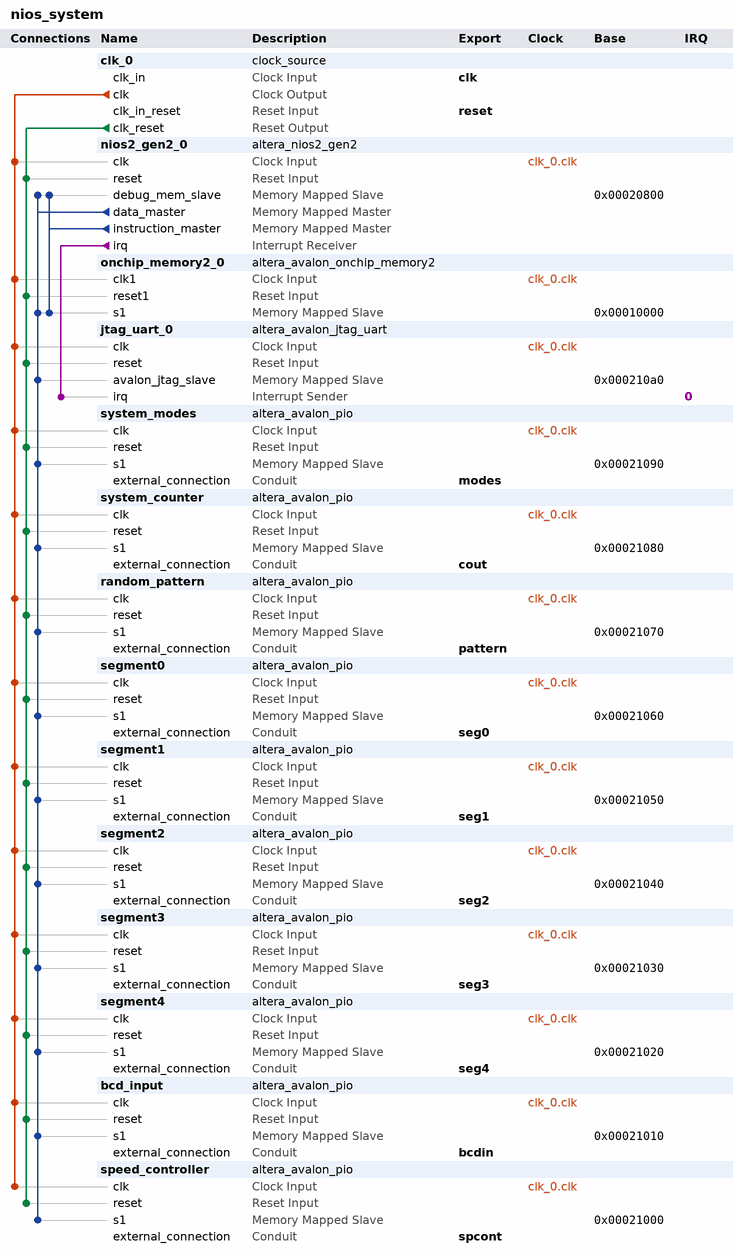
[diagram p0: system contents]
# Platform Designer (Qsys) system nios_system, Cyclone IV E EP4CE115F29C7
# Parameters at their usual value, and those the tool derives, are not listed.
package require -exact qsys 18.1
create_system nios_system
set_project_property DEVICE_FAMILY {Cyclone IV E}
set_project_property DEVICE EP4CE115F29C7

add_instance clk_0 clock_source 18.1
set_instance_parameter_value clk_0 clockFrequency 50000000

add_instance nios2_gen2_0 altera_nios2_gen2 18.1
set_instance_parameter_value nios2_gen2_0 dcache_size 4096
set_instance_parameter_value nios2_gen2_0 exceptionSlave onchip_memory2_0.s1
set_instance_parameter_value nios2_gen2_0 icache_size 4096
set_instance_parameter_value nios2_gen2_0 impl Fast
set_instance_parameter_value nios2_gen2_0 resetSlave onchip_memory2_0.s1

add_instance onchip_memory2_0 altera_avalon_onchip_memory2 18.1
set_instance_parameter_value onchip_memory2_0 dataWidth 32
set_instance_parameter_value onchip_memory2_0 dualPort false
set_instance_parameter_value onchip_memory2_0 initMemContent true
set_instance_parameter_value onchip_memory2_0 initializationFileName onchip_mem.hex
set_instance_parameter_value onchip_memory2_0 memorySize 65536

add_instance jtag_uart_0 altera_avalon_jtag_uart 18.1
set_instance_parameter_value jtag_uart_0 simInteractiveOptions NO_INTERACTIVE_WINDOWS

add_instance system_modes altera_avalon_pio 18.1
set_instance_parameter_value system_modes direction Input
set_instance_parameter_value system_modes width 2

add_instance system_counter altera_avalon_pio 18.1
set_instance_parameter_value system_counter direction Output
set_instance_parameter_value system_counter width 8

add_instance random_pattern altera_avalon_pio 18.1
set_instance_parameter_value random_pattern direction Output
set_instance_parameter_value random_pattern width 18

add_instance segment0 altera_avalon_pio 18.1
set_instance_parameter_value segment0 direction Output
set_instance_parameter_value segment0 width 8

add_instance segment1 altera_avalon_pio 18.1
set_instance_parameter_value segment1 direction Output
set_instance_parameter_value segment1 width 8

add_instance segment2 altera_avalon_pio 18.1
set_instance_parameter_value segment2 direction Output
set_instance_parameter_value segment2 width 8

add_instance segment3 altera_avalon_pio 18.1
set_instance_parameter_value segment3 direction Output
set_instance_parameter_value segment3 width 8

add_instance segment4 altera_avalon_pio 18.1
set_instance_parameter_value segment4 direction Output
set_instance_parameter_value segment4 width 8

add_instance bcd_input altera_avalon_pio 18.1
set_instance_parameter_value bcd_input direction Input
set_instance_parameter_value bcd_input width 4

add_instance speed_controller altera_avalon_pio 18.1
set_instance_parameter_value speed_controller direction Input
set_instance_parameter_value speed_controller width 1

# connections
add_connection clk_0.clk bcd_input.clk clock
add_connection clk_0.clk jtag_uart_0.clk clock
add_connection clk_0.clk nios2_gen2_0.clk clock
add_connection clk_0.clk onchip_memory2_0.clk1 clock
add_connection clk_0.clk random_pattern.clk clock
add_connection clk_0.clk segment0.clk clock
add_connection clk_0.clk segment1.clk clock
add_connection clk_0.clk segment2.clk clock
add_connection clk_0.clk segment3.clk clock
add_connection clk_0.clk segment4.clk clock
add_connection clk_0.clk speed_controller.clk clock
add_connection clk_0.clk system_counter.clk clock
add_connection clk_0.clk system_modes.clk clock
add_connection clk_0.clk_reset bcd_input.reset reset
add_connection clk_0.clk_reset jtag_uart_0.reset reset
add_connection clk_0.clk_reset nios2_gen2_0.reset reset
add_connection clk_0.clk_reset onchip_memory2_0.reset1 reset
add_connection clk_0.clk_reset random_pattern.reset reset
add_connection clk_0.clk_reset segment0.reset reset
add_connection clk_0.clk_reset segment1.reset reset
add_connection clk_0.clk_reset segment2.reset reset
add_connection clk_0.clk_reset segment3.reset reset
add_connection clk_0.clk_reset segment4.reset reset
add_connection clk_0.clk_reset speed_controller.reset reset
add_connection clk_0.clk_reset system_counter.reset reset
add_connection clk_0.clk_reset system_modes.reset reset
add_connection nios2_gen2_0.data_master bcd_input.s1 avalon
set_connection_parameter_value nios2_gen2_0.data_master/bcd_input.s1 baseAddress 0x00021010
add_connection nios2_gen2_0.data_master jtag_uart_0.avalon_jtag_slave avalon
set_connection_parameter_value nios2_gen2_0.data_master/jtag_uart_0.avalon_jtag_slave baseAddress 0x000210a0
add_connection nios2_gen2_0.data_master nios2_gen2_0.debug_mem_slave avalon
set_connection_parameter_value nios2_gen2_0.data_master/nios2_gen2_0.debug_mem_slave baseAddress 0x00020800
add_connection nios2_gen2_0.data_master onchip_memory2_0.s1 avalon
set_connection_parameter_value nios2_gen2_0.data_master/onchip_memory2_0.s1 baseAddress 0x00010000
add_connection nios2_gen2_0.data_master random_pattern.s1 avalon
set_connection_parameter_value nios2_gen2_0.data_master/random_pattern.s1 baseAddress 0x00021070
add_connection nios2_gen2_0.data_master segment0.s1 avalon
set_connection_parameter_value nios2_gen2_0.data_master/segment0.s1 baseAddress 0x00021060
add_connection nios2_gen2_0.data_master segment1.s1 avalon
set_connection_parameter_value nios2_gen2_0.data_master/segment1.s1 baseAddress 0x00021050
add_connection nios2_gen2_0.data_master segment2.s1 avalon
set_connection_parameter_value nios2_gen2_0.data_master/segment2.s1 baseAddress 0x00021040
add_connection nios2_gen2_0.data_master segment3.s1 avalon
set_connection_parameter_value nios2_gen2_0.data_master/segment3.s1 baseAddress 0x00021030
add_connection nios2_gen2_0.data_master segment4.s1 avalon
set_connection_parameter_value nios2_gen2_0.data_master/segment4.s1 baseAddress 0x00021020
add_connection nios2_gen2_0.data_master speed_controller.s1 avalon
set_connection_parameter_value nios2_gen2_0.data_master/speed_controller.s1 baseAddress 0x00021000
add_connection nios2_gen2_0.data_master system_counter.s1 avalon
set_connection_parameter_value nios2_gen2_0.data_master/system_counter.s1 baseAddress 0x00021080
add_connection nios2_gen2_0.data_master system_modes.s1 avalon
set_connection_parameter_value nios2_gen2_0.data_master/system_modes.s1 baseAddress 0x00021090
add_connection nios2_gen2_0.instruction_master nios2_gen2_0.debug_mem_slave avalon
set_connection_parameter_value nios2_gen2_0.instruction_master/nios2_gen2_0.debug_mem_slave baseAddress 0x00020800
add_connection nios2_gen2_0.instruction_master onchip_memory2_0.s1 avalon
set_connection_parameter_value nios2_gen2_0.instruction_master/onchip_memory2_0.s1 baseAddress 0x00010000
add_connection nios2_gen2_0.irq jtag_uart_0.irq interrupt
set_connection_parameter_value nios2_gen2_0.irq/jtag_uart_0.irq irqNumber 0

# exported interfaces
add_interface bcdin conduit end
set_interface_property bcdin EXPORT_OF bcd_input.external_connection
add_interface clk clock sink
set_interface_property clk EXPORT_OF clk_0.clk_in
add_interface cout conduit end
set_interface_property cout EXPORT_OF system_counter.external_connection
add_interface modes conduit end
set_interface_property modes EXPORT_OF system_modes.external_connection
add_interface pattern conduit end
set_interface_property pattern EXPORT_OF random_pattern.external_connection
add_interface reset reset sink
set_interface_property reset EXPORT_OF clk_0.clk_in_reset
add_interface seg0 conduit end
set_interface_property seg0 EXPORT_OF segment0.external_connection
add_interface seg1 conduit end
set_interface_property seg1 EXPORT_OF segment1.external_connection
add_interface seg2 conduit end
set_interface_property seg2 EXPORT_OF segment2.external_connection
add_interface seg3 conduit end
set_interface_property seg3 EXPORT_OF segment3.external_connection
add_interface seg4 conduit end
set_interface_property seg4 EXPORT_OF segment4.external_connection
add_interface spcont conduit end
set_interface_property spcont EXPORT_OF speed_controller.external_connection

set_interconnect_requirement {$system} qsys_mm.clockCrossingAdapter HANDSHAKE
set_interconnect_requirement {$system} qsys_mm.enableEccProtection FALSE
set_interconnect_requirement {$system} qsys_mm.insertDefaultSlave FALSE
set_interconnect_requirement {$system} qsys_mm.maxAdditionalLatency 1

save_system nios_system.qsys
